# Altium schematic sheet P02_XDS100v2.SchDoc
size 301 x 239 mm; Revision: 2.0; PageSetup: Record=PageOptions|CenterHorizontal=True|CenterVertical=True|PrintScale=1.00|XCorrection=1.00|YCorrection=1.00|PrintKind=1|BorderSize=5000000|LeftOffset=0|BottomOffset=0|Orientation=2|PaperLength=1000|PaperWidth=1000|Scale=100|PaperSource=7|PrintQuality=-3|MediaType=1|DitherType=10|PrintScaleMode=1|PaperKind=A4 (210 x 297 mm)|PaperIndex=9
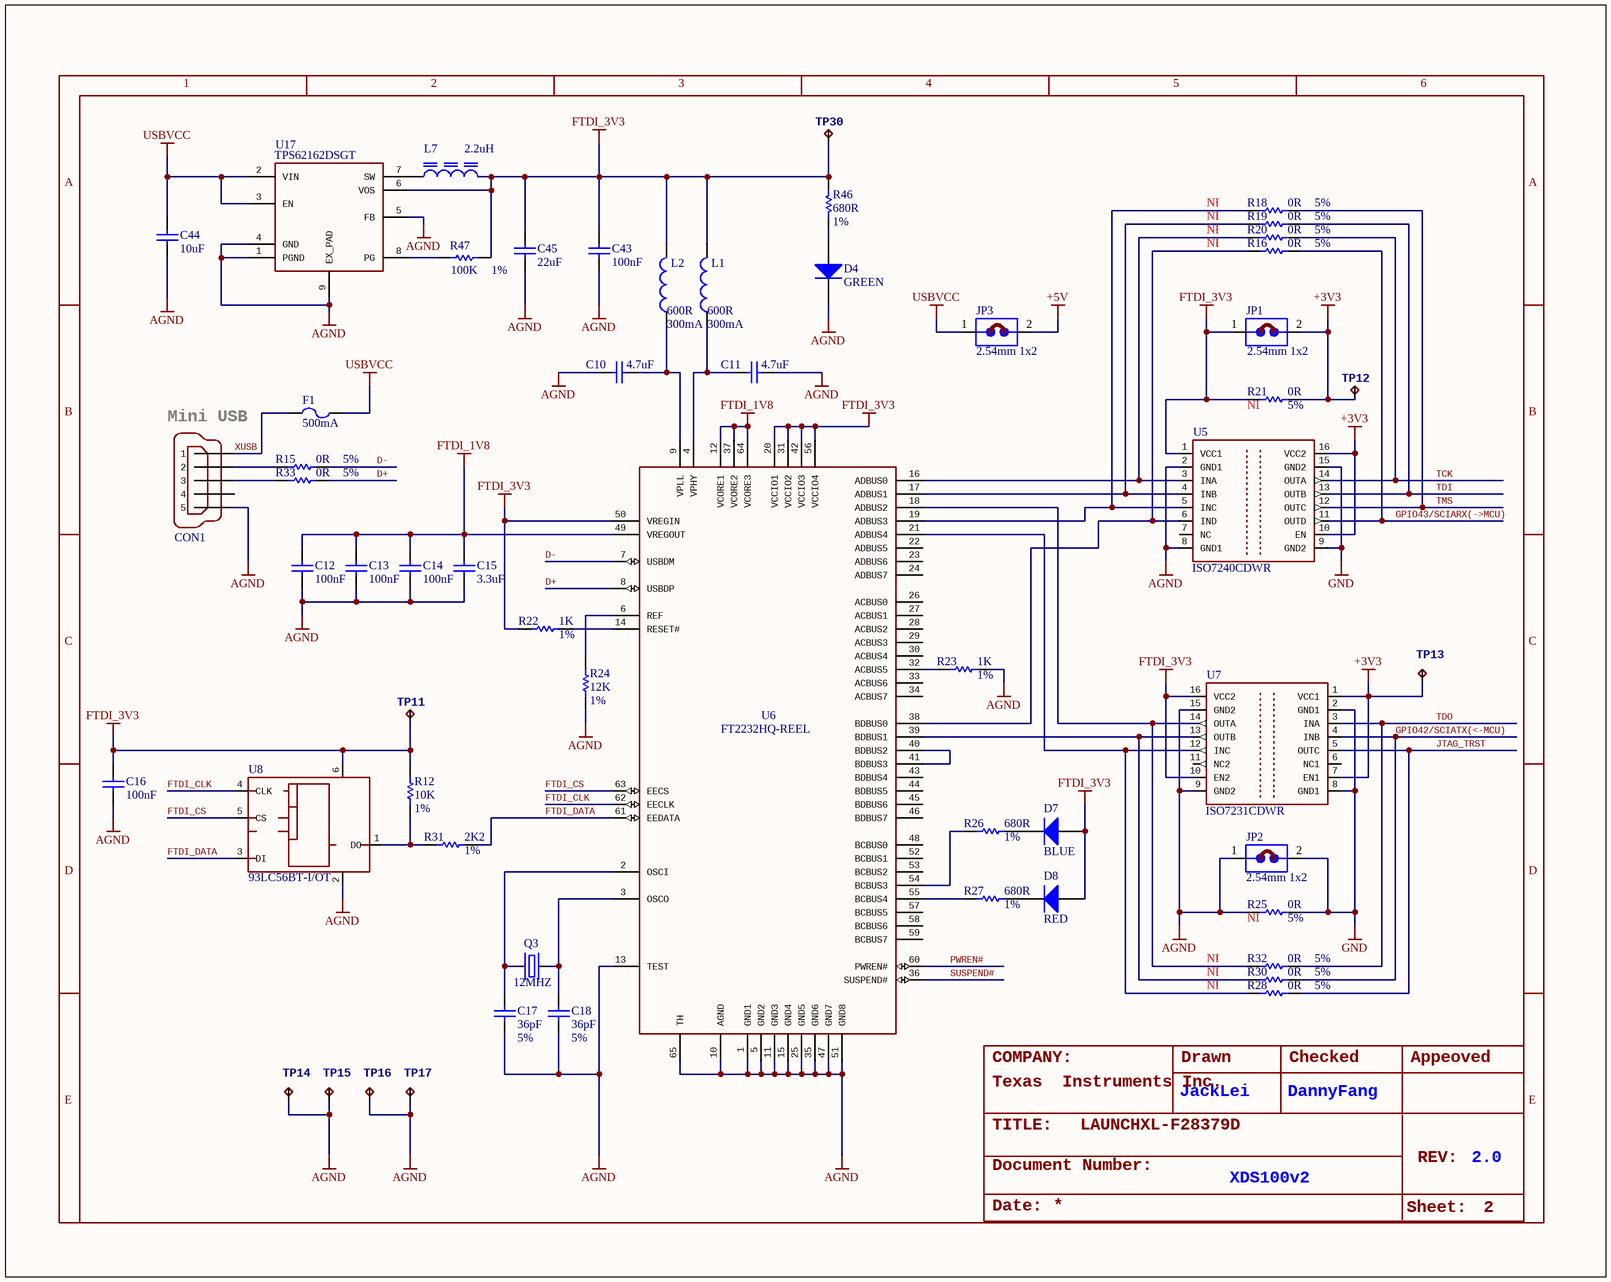
[diagram p0: P02_XDS100v2.SchDoc]

## Parts
C10  4.7uF  [C0402]
C11  4.7uF  [C0402]
C12  100nF  [C0402]
C13  100nF  [C0402]
C14  100nF  [C0402]
C15  3.3uF  [C0603]
C16  100nF  [C0402]
C17  Rating: 5%  [C0402]  (hidden comment: 36pF)
C18  Rating: 5%  [C0402]  (hidden comment: 36pF)
C43  100nF  [C0402]
C44  10uF  [C1210]
C45  22uF  [C1210]
CON1  897-43-005-00-100001  [USB-MINI-B-5P-SMD]  (value not drawn)
D4  value GREEN  [D0805]  (hidden comment: 150080VS75000)
D7  value BLUE  [D0805]  (hidden comment: 150080BS75000)
D8  value RED  [D0805]  (hidden comment: 150080SS75000)
F1  value 500mA  [FUSM4632X85N]  (hidden comment: MF-MSMF050-2)
JP1  value 2.54mm 1x2  [HDRV2W64P254_1X2_508X250X850P]  (hidden comment: P6E02A-602530-B1)
JP2  value 2.54mm 1x2  [HDRV2W64P254_1X2_508X250X850P]  (hidden comment: P6E02A-602530-B1)
JP3  value 2.54mm 1x2  [HDRV2W64P254_1X2_508X250X850P]  (hidden comment: P6E02A-602530-B1)
L1  Rating: 300mA  [L0402]  (hidden comment: 600R)
L2  Rating: 300mA  [L0402]  (hidden comment: 600R)
L7  2.2uH  [INDC300X300X180N]
Q3  value 12MHZ  [XTAL1140X470X330N]  (hidden comment: ABLS2-12.000MHZ-D4Y-T)
R12  Rating: 1%  [R0402]  (hidden comment: 10K)
R15  Rating: 5%  [R0402]  (hidden comment: 0R)
R16  Rating: 5%  ASSY: NI  [R1206]  (hidden comment: 0R)
R18  Rating: 5%  ASSY: NI  [R1206]  (hidden comment: 0R)
R19  Rating: 5%  ASSY: NI  [R1206]  (hidden comment: 0R)
R20  Rating: 5%  ASSY: NI  [R1206]  (hidden comment: 0R)
R21  Rating: 5%  ASSY: NI  [R1206]  (hidden comment: 0R)
R22  Rating: 1%  [R0402]  (hidden comment: 1K)
R23  Rating: 1%  [R0402]  (hidden comment: 1K)
R24  Rating: 1%  [R0402]  (hidden comment: 12K)
R25  Rating: 5%  ASSY: NI  [R1206]  (hidden comment: 0R)
R26  Rating: 1%  [R0402]  (hidden comment: 680R)
R27  Rating: 1%  [R0402]  (hidden comment: 680R)
R28  Rating: 5%  ASSY: NI  [R1206]  (hidden comment: 0R)
R30  Rating: 5%  ASSY: NI  [R1206]  (hidden comment: 0R)
R31  Rating: 1%  [R0402]  (hidden comment: 2K2)
R32  Rating: 5%  ASSY: NI  [R1206]  (hidden comment: 0R)
R33  Rating: 5%  [R0402]  (hidden comment: 0R)
R46  Rating: 1%  [R0402]  (hidden comment: 680R)
R47  Rating: 1%  [R0402]  (hidden comment: 100K)
TP11  TESTPAD_TPB1,27  [TESTPAD_B1,27]  (value not drawn)
TP12  TESTPAD_TPB1,27  [TESTPAD_B1,27]  (value not drawn)
TP13  TESTPAD_TPB1,27  [TESTPAD_B1,27]  (value not drawn)
TP14  TESTPAD_TPB1,27  [TESTPAD_B1,27]  (value not drawn)
TP15  TESTPAD_TPB1,27  [TESTPAD_B1,27]  (value not drawn)
TP16  TESTPAD_TPB1,27  [TESTPAD_B1,27]  (value not drawn)
TP17  TESTPAD_TPB1,27  [TESTPAD_B1,27]  (value not drawn)
TP30  TESTPAD_TPB1,27  [TESTPAD_B1,27]  (value not drawn)
U5  ISO7240CDWR  [SOIC127P1030X265-16N]
U6  FT2232HQ-REEL  [QFN50P900X900X100_HS-65N]
U7  ISO7231CDWR  [SOIC127P1030X265-16N]
U8  93LC56BT-I/OT  [SOT23-6]
U17  TPS62162DSGT  [WSON50P200X80_HS-9N]
U$2  ROY_JUMPER  [ROY_JUMPER]  (value not drawn)
U$10  ROY_JUMPER  [ROY_JUMPER]  (value not drawn)
U$11  ROY_JUMPER  [ROY_JUMPER]  (value not drawn)

## Nets
+3V3: JP1.2 R21.2 TP12.TP TP13.TP U5.10(EN) U5.16(VCC2) U7.1(VCC1) U7.7(EN1)
+5V: JP3.2
AGND: C10.1 C11.1 C12.1 C13.1 C14.1 C15.1 C16.1 C17.1 C18.1 C43.1 C44.2 C45.1 CON1.5 D4.1 JP2.1 R23.2 R24.1 R25.1 TP14.TP TP15.TP TP16.TP TP17.TP U5.2(GND1) U5.8(GND1) U6.1(GND1) U6.5(GND2) U6.10(AGND) U6.11(GND3) U6.13(TEST) U6.15(GND4) U6.25(GND5) U6.35(GND6) U6.47(GND7) U6.51(GND8) U6.65(TH) U7.9(GND2) U7.15(GND2) U8.2(GND) U17.1(PGND) U17.4(GND) U17.5(FB) U17.9(EX_PAD)
FTDI_1V8: C12.2 C13.2 C14.2 C15.2 U6.12(VCORE1) U6.37(VCORE2) U6.49(VREGOUT) U6.64(VCORE3)
FTDI_3V3: C16.2 C43.2 C45.2 D7.2 D8.2 JP1.1 L1.2 L2.2 L7.1 R12.1 R21.1 R22.1 R46.2 R47.1 TP11.TP TP30.TP U5.1(VCC1) U6.20(VCCIO1) U6.31(VCCIO2) U6.42(VCCIO3) U6.50(VREGIN) U6.56(VCCIO4) U7.10(EN2) U7.16(VCC2) U8.6(VCC) U17.6(VOS)
GND: JP2.2 R25.2 U5.9(GND2) U5.15(GND2) U7.2(GND1) U7.8(GND1)
USBVCC: C44.1 F1.2 JP3.1 U17.2(VIN) U17.3(EN)
D+: R33.2 U6.8(USBDP)
D-: R15.2 U6.7(USBDM)
FTDI_CLK: U6.62(EECLK) U8.4(CLK)
FTDI_CS: U6.63(EECS) U8.5(CS)
FTDI_DATA: R31.2 U6.61(EEDATA) U8.3(DI)
GPIO42/SCIATX(<-MCU): R30.2 U7.4(INB)
GPIO43/SCIARX(->MCU): R16.2 U5.11(OUTD)
JTAG_TRST: R28.2 U7.5(OUTC)
PWREN#: U6.60(PWREN#)
SUSPEND#: U6.36(SUSPEND#)
TCK: R20.2 U5.14(OUTA)
TDI: R19.2 U5.13(OUTB)
TDO: R32.2 U7.3(INA)
TMS: R18.2 U5.12(OUTC)
XUSB: CON1.1 F1.1
NetC10_2: C10.2 L2.1 U6.9(VPLL)
NetC11_2: C11.2 L1.1 U6.4(VPHY)
NetC17_2: C17.2 Q3.1 U6.2(OSCI)
NetC18_2: C18.2 Q3.2 U6.3(OSCO)
NetCON1_2: CON1.2 R15.1
NetCON1_3: CON1.3 R33.1
NetD4_2: D4.2 R46.1
NetD7_1: D7.1 R26.2
NetD8_1: D8.1 R27.2
NetL7_2: L7.2 U17.7(SW)
NetR12_2: R12.2 R31.1 U8.1(DO)
NetR16_1: R16.1 U5.6(IND) U6.38(BDBUS0)
NetR18_1: R18.1 U5.5(INC) U6.19(ADBUS3)
NetR19_1: R19.1 U5.4(INB) U6.17(ADBUS1)
NetR20_1: R20.1 U5.3(INA) U6.16(ADBUS0)
NetR22_2: R22.2 U6.14(RESET#)
NetR23_1: R23.1 U6.32(ACBUS5)
NetR24_2: R24.2 U6.6(REF)
NetR26_1: R26.1 U6.54(BCBUS3)
NetR27_1: R27.1 U6.55(BCBUS4)
NetR28_1: R28.1 U6.21(ADBUS4) U7.12(INC)
NetR30_1: R30.1 U6.39(BDBUS1) U7.13(OUTB)
NetR32_1: R32.1 U6.18(ADBUS2) U7.14(OUTA)
NetR47_2: R47.2 U17.8(PG)
NetU6_40: U6.40(BDBUS2) U6.41(BDBUS3)

Not connected (* = marked no-connect by the designer): CON1 4; U5 7(NC); U6 22(ADBUS5) 23(ADBUS6) 24(ADBUS7) 26(ACBUS0) 27(ACBUS1) 28(ACBUS2) 29(ACBUS3) 30(ACBUS4) 33(ACBUS6) 34(ACBUS7) 43(BDBUS4) 44(BDBUS5) 45(BDBUS6) 46(BDBUS7) 48(BCBUS0) 52(BCBUS1) 53(BCBUS2) 57(BCBUS5) 58(BCBUS6) 59(BCBUS7); U7 6(NC1) 11(NC2)

## Notes on the sheet
- (near CON1) Mini USB
- COMPANY:
- Texas
  Instruments Inc.
- JackLei
- Drawn
- DannyFang
- Checked
- Appeoved
- TITLE:
- Document Number:
- LAUNCHXL-F28379D
- REV:
- Date:
- XDS100v2
- Sheet:
- 2
- 1
- 3
- 4
- 5
- 6
- A
- B
- C
- D
- E

## Library data of the parts
C10 C11 = 1004001100218: CAP,4.7UF,+/-20%,X5R,6.3V,SMD0402 fix PN add D（20151023）; Manufacturer: MURATA; Manufacturer Part Number: GRM155R60J475ME47D; Rating: 20%; Embest PN: 1004001100218; Value: 4.7uF; Part Type: Ceramic Capacitor
C12-C14 C16 C43 = 1004001100187: CAP,100NF(0.1uf),+/-10%,X5R,10V,SMD0402; Manufacturer: MURATA; Manufacturer Part Number: GRM155R61A104KA01D; Rating: 10%; Embest PN: 1004001100187; Value: 100nF; Part Type: Ceramic Capacitor
C15 = 1004001100252: CAP,3.3uF,+/-10%,X5R,10V,SMD0603; Manufacturer: MURATA; Manufacturer Part Number: GRM188R61A335KE15D; Rating: 10%; Embest PN: 1004001100252; Value: 3.3uF; Part Type: Ceramic Capacitor
C17 C18 = 1004001100255: CAP,36pF,+/-5%,C0G,50V,SMD0402; Manufacturer: MURATA; Manufacturer Part Number: GRM1555C1H360JA01D; Embest PN: 1004001100255; Value: 36pF; Part Type: Ceramic Capacitor
C44 = 1004001100183: CAP,10UF,+/-10%,X7R,25V,SMD1210; Manufacturer: MURATA; Manufacturer Part Number: GRM32DR71E106KA12L; Rating: 10%; Embest PN: 1004001100183; Value: 10uF; Part Type: Ceramic Capacitor
C45 = 1004001100216: CAP,22UF,+/-10%,X7R,25V,SMD1210; Manufacturer: MURATA; Manufacturer Part Number: GRM32ER61E226KE15L; Rating: 10%; Embest PN: 1004001100216; Value: 22uF; Part Type: Ceramic Capacitor
CON1 = 1009007100067: Connector,MiniUSB B port,5 position,Right Angle,Gold flash 30u,black,SMD; Manufacturer: MILL-MAX; Embest PN: 1009007100067; Value: 897-43-005-00-100001; Part Type: USB Connector; Manufacturer Part Number: 897-43-005-00-100001
D4 = 1006001100166: LED, Bright GREEN , 570nm,30mA,SMD,0805; Manufacturer: WURTH; Embest PN: 1006001100166; Part Type: LED; Manufacturer Part Number: 150080VS75000
D7 = 1006001100167: LED, BLUE ,470NM, 30mA,SMD,0805; Manufacturer: WURTH; Embest PN: 1006001100167; Part Type: LED; Manufacturer Part Number: 150080BS75000
D8 = 1006001100168: LED, SUPPER RED ,630NM,30mA, SMD,0805; Manufacturer: WURTH; Embest PN: 1006001100168; Part Type: LED; Manufacturer Part Number: 150080SS75000
F1 = 1007001100029: PTC RESETTABLE .50A 15V 1812; Manufacturer: BOURNS; Embest PN: 1007001100029; Part Type: Polyswitch; Manufacturer Part Number: MF-MSMF050-2
JP1-JP3 = 1009001200003: Connector,Pin Header,Straight,Male,1x2Pin,2.54MM pitch,6.00,3.00,Gold Flash 1u, black,DIP,alt_code:15071705; Manufacturer: CHIN-BAN; Embest PN: 1009001200003; Part Type: Pin Header; Manufacturer Part Number: P6E02A-602530-B1
L1 L2 = 1005005100003: Ferrite Bead,600ohm@100MHz,+/-25%,300mA,0.6ohm,SMD0402; Manufacturer: MURATA; Manufacturer Part Number: BLM15AG601SN1D; Embest PN: 1005005100003; Value: 600R; Part Type: Ferrite Bead
L7 = 1005004100011: Power Inductor,Magnetic shielded,2.2uH,1.6A,0.06ohm,3.0X3.0X1.8mm,SMD; Manufacturer: SUMIDA; Manufacturer Part Number: CDRH2D18/HPNP-2R2NC; Embest PN: 1005004100011; Value: 2.2uH; Part Type: Inductor; Rating: 1.6A
Q3 = 1008002100130: Crystal 12MHz ±30ppm (Tol) ±30ppm (Stability) 18pF FUND 50Ohm 2-Pin HC-49/US SMD T/R; Manufacturer: ABRACON; Embest PN: 1008002100130; Part Type: Crystal; Manufacturer Part Number: ABLS2-12.000MHZ-D4Y-T
R12 = 1003001100071: RES,10K,+/-1%,1/16W,SMD0402; Manufacturer: YAGEO; Manufacturer Part Number: RC0402FR-0710KL; Embest PN: 1003001100071; Value: 10K; Part Type: Thick film Resistor
R15 R33 = 1003001100001: RES,0R,+/-5%,1/16W,SMD0402; Manufacturer: YAGEO; Manufacturer Part Number: RC0402JR-070RL; Embest PN: 1003001100001; Value: 0R; Part Type: Thick film Resistor
R16 R18-R21 R25 R28 R30 R32 = 1003001100325: RES,0R,+/-5%,1/2W,SMD1206; Manufacturer: YAGEO; Manufacturer Part Number: RC1206JR-7W0RL; Embest PN: 1003001100325; Value: 0R; Part Type: Thick film Resistor
R22 R23 = 1003001100034: RES,1K,+/-1%,1/16W,SMD0402; Manufacturer: YAGEO; Manufacturer Part Number: RC0402FR-071KL; Embest PN: 1003001100034; Value: 1K; Part Type: Thick film Resistor
R24 = 1003001100075: RES,12K,+/-1%,1/16W,SMD0402; Manufacturer: YAGEO; Manufacturer Part Number: RC0402FR-0712KL; Embest PN: 1003001100075; Value: 12K; Part Type: Thick film Resistor
R26 R27 R46 = 1003001100490: RES,680R,+/-1%,1/16W,SMD0402; Manufacturer: YAGEO; Manufacturer Part Number: RC0402FR-07680RL; Embest PN: 1003001100490; Value: 680R; Part Type: Thick film Resistor
R31 = 1003001100045: RES,2K2,+/-1%,1/16W,SMD0402; Manufacturer: YAGEO; Manufacturer Part Number: RC0402FR-072K2L; Embest PN: 1003001100045; Value: 2K2; Part Type: Thick film Resistor
R47 = 1003001100120: RES,100K,+/-1%,1/16W,SMD0402; Manufacturer: YAGEO; Manufacturer Part Number: RC0402FR-07100KL; Embest PN: 1003001100120; Value: 100K; Part Type: Thick film Resistor
TP11-TP17 TP30 = TESTPAD_TPB1,27: Test pad
U5 = 1002017100004C: IC DGTL ISO 4CH CMOS 16SOIC,CUSTOMER SUPPLY; Manufacturer: TI; Embest PN: 1002017100004C; Value: ISO7240CDWR; Part Type: Isolator; Manufacturer Part Number: ISO7240CDWR
U6 = 1002010100084: IC,Dual High Speed USB to Multipurpose UART/FIFO IC,FT2232HQ-REEL,QFN-64,SMD; Manufacturer: FTDI; Embest PN: 1002010100084; Value: FT2232HQ-REEL; Part Type: Interface; Manufacturer Part Number: FT2232HQ-REEL
U7 = 1002017100003C: IC DGTL ISO 3CH CMOS 16SOIC,CUSTOMER SUPPLY; Manufacturer: TI; Embest PN: 1002017100003C; Value: ISO7231CDWR; Part Type: Isolator; Manufacturer Part Number: ISO7231CDWR
U8 = 1002003100163: IC,EEPROM Serial-Microwire 2K-Bit 128 x 16 2MHz,93LC56BT-I/OT,SOT-23-6,SMD; Manufacturer: MICROCHIP; Embest PN: 1002003100163; Value: 93LC56BT-I/OT; Part Type: Memory; Manufacturer Part Number: 93LC56BT-I/OT
U17 = 1002005100090C: IC REG BUCK SYNC 3.3V 1A 8WSON; Manufacturer: TI; Embest PN: 1002005100090C; Value: TPS62162DSGT; Part Type: DC-DC; Manufacturer Part Number: TPS62162DSGT